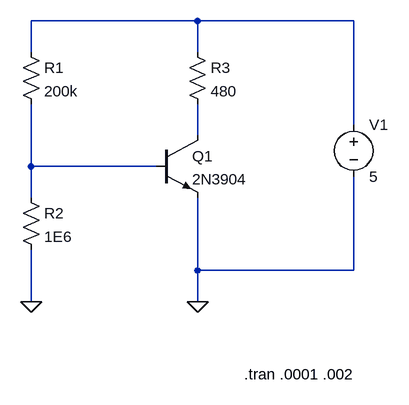
[diagram p0: schematic Draft2.asc]
Draft2.asc, the LTspice schematic file:
Version 4
SHEET 1 880 680
WIRE 416 80 160 80
WIRE 656 80 416 80
WIRE 160 128 160 80
WIRE 416 128 416 80
WIRE 656 240 656 80
WIRE 416 256 416 208
WIRE 160 304 160 208
WIRE 352 304 160 304
WIRE 160 352 160 304
WIRE 416 464 416 352
WIRE 656 464 656 320
WIRE 656 464 416 464
WIRE 160 512 160 432
WIRE 416 512 416 464
FLAG 416 512 0
FLAG 160 512 0
SYMBOL Res 144 112 R0
SYMATTR InstName R1
SYMATTR Value 200k
SYMBOL Res 144 336 R0
SYMATTR InstName R2
SYMATTR Value 1E6
SYMBOL Res 400 112 R0
SYMATTR InstName R3
SYMATTR Value 480
SYMBOL Voltage 656 224 R0
SYMATTR InstName V1
SYMATTR Value 5
SYMBOL npn 352 256 R0
SYMATTR InstName Q1
SYMATTR Value 2N3904
TEXT 488 624 Left 2 !.tran .0001 .002

The netlist it stands for:
* Draft2.asc
R1 N001 N003 200k
R2 N003 0 1E6
R3 N001 N002 480
V1 N001 0 5
Q1 N002 N003 0 0 2N3904
.model NPN NPN
.model PNP PNP
.lib standard.bjt
.tran .0001 .002
.backanno
.end